# EAGLE design Tx_ckt_1 (EAGLE 9.6.2)
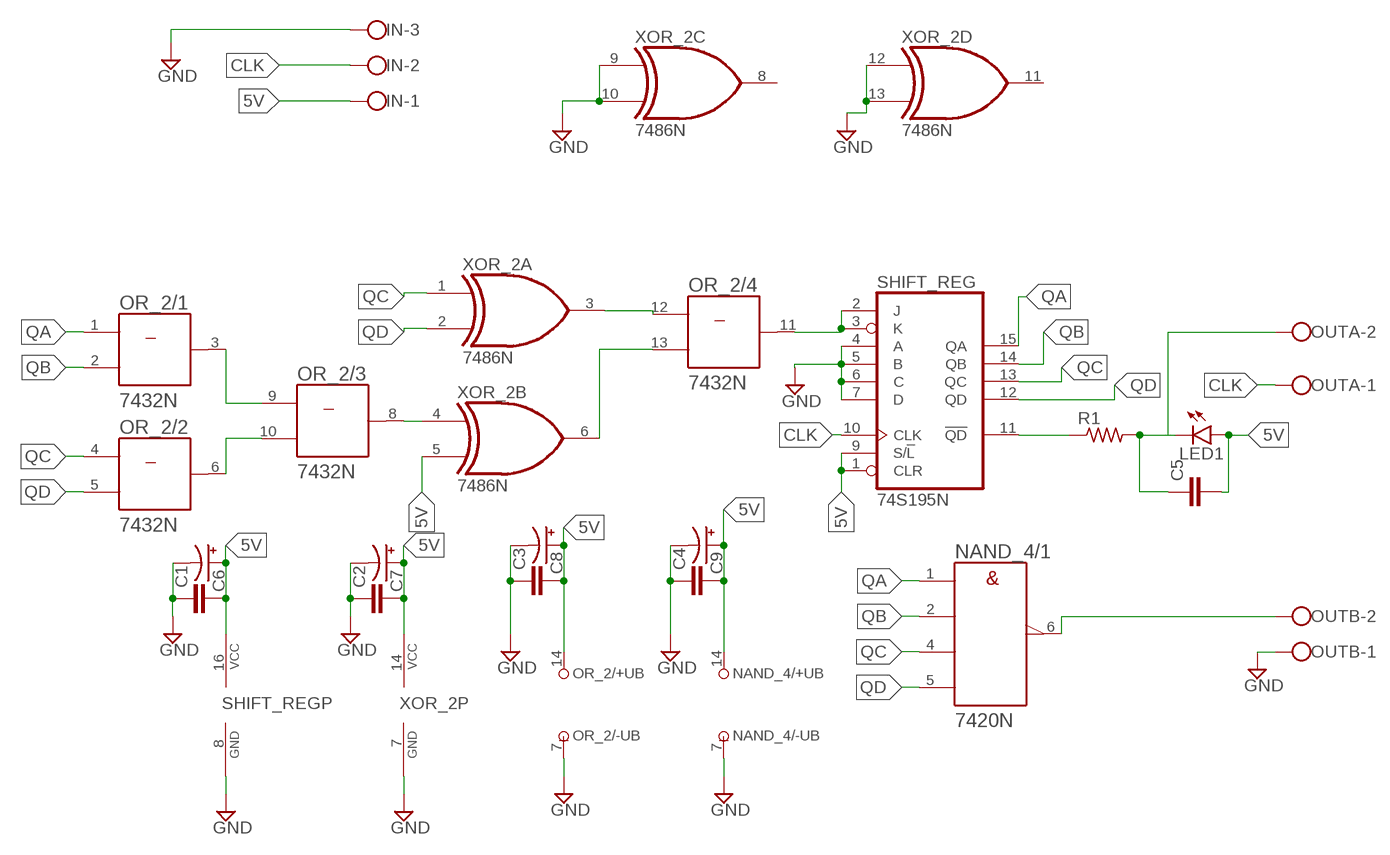
[diagram p0: schematic, sheet 1]

## Parts
C1  C-EU050-025X075  [C050-025X075]
C2  C-EU050-025X075  [C050-025X075]
C3  C-EU050-025X075  [C050-025X075]
C4  C-EU050-025X075  [C050-025X075]
C5  C-EU050-025X075  [C050-025X075]
C6  CPOL-USE2.5-7  [E2,5-7]
C7  CPOL-USE2.5-7  [E2,5-7]
C8  CPOL-USE2.5-7  [E2,5-7]
C9  CPOL-USE2.5-7  [E2,5-7]
IN  W237-103  [W237-103]
LED1  LED5MM  [LED5MM]
NAND_4  7420N  [DIL14]
OR_2  7432N  [DIL14]
OUTA  W237-102  [W237-102]
OUTB  W237-102  [W237-102]
R1  R-US_0207/10  [0207/10]
SHIFT_REG  74S195N  [DIL16]
XOR_2  7486N  [DIL14]

## Nets
5V: C1.2 C2.2 C3.2 C4.2 C5.2 C6.+ C7.+ C8.+ C9.+ IN.1 LED1.A NAND_4.14(/+UB:+UB) OR_2.14(/+UB:+UB) SHIFT_REG.1(CLR) SHIFT_REG.9(S/!L) SHIFT_REG.16(VCC) XOR_2.5(B:I1) XOR_2.14(P:VCC)
CLK: IN.2 OUTA.1 SHIFT_REG.10(CLK)
GND: C1.1 C2.1 C3.1 C4.1 C6.- C7.- C8.- C9.- IN.3 NAND_4.7(/-UB:-UB) OR_2.7(/-UB:-UB) OUTB.1 SHIFT_REG.4(A) SHIFT_REG.5(B) SHIFT_REG.6(C) SHIFT_REG.7(D) SHIFT_REG.8(GND) XOR_2.7(P:GND) XOR_2.9(C:I0) XOR_2.10(C:I1) XOR_2.12(D:I0) XOR_2.13(D:I1)
N$1: OR_2.11(/4:Y) SHIFT_REG.2(J) SHIFT_REG.3(K)
N$2: OR_2.12(/4:A) XOR_2.3(A:O)
N$3: OR_2.13(/4:B) XOR_2.6(B:O)
N$4: R1.1 SHIFT_REG.11(!QD)
N$5: C5.1 LED1.K(C) OUTA.2 R1.2
N$7: NAND_4.6(/1:Y) OUTB.2
N$8: OR_2.3(/1:Y) OR_2.9(/3:A)
N$9: OR_2.6(/2:Y) OR_2.10(/3:B)
N$10: OR_2.8(/3:Y) XOR_2.4(B:I0)
QA: NAND_4.1(/1:A) OR_2.1(/1:A) SHIFT_REG.15(QA)
QB: NAND_4.2(/1:B) OR_2.2(/1:B) SHIFT_REG.14(QB)
QC: NAND_4.4(/1:C) OR_2.4(/2:A) SHIFT_REG.13(QC) XOR_2.1(A:I0)
QD: NAND_4.5(/1:D) OR_2.5(/2:B) SHIFT_REG.12(QD) XOR_2.2(A:I1)
Unconnected: NAND_4.8(/2:Y) NAND_4.9(/2:A) NAND_4.10(/2:B) NAND_4.12(/2:C) NAND_4.13(/2:D) XOR_2.8(C:O) XOR_2.11(D:O)

## Library data of the parts
C1-C5 = rcl:C-EU: CAPACITOR, European symbol; SPICEPREFIX: C
C6-C9 = rcl:CPOL-US: POLARIZED CAPACITOR, American symbol; SPICEPREFIX: C
IN = con-wago-500:W237-103: WAGO SCREW CLAMP; MPN: 237-103; OC_FARNELL: unknown; OC_NEWARK: 18M7116
LED1 = led:LED: LED OSRAM: - CHIPLED LG R971, LG N971, LY N971, LG Q971, LY Q971, LO R971, LY R971 LH N974, LH R974 LS Q976, LO Q976, LY Q976 LO Q996 - Hyper CHIPLED LW Q18S LB Q993, LB Q99A, LB R99A - SideLED LS A670, LO A670, LY A670, LG A670, LP A670 LB A673, LV A673, LT A673, LW A673 LH A674 LY A675 LS A676, LA A676, LO A676, LY A676, LW A676 LS A679, LY A679, LG A679 - Hyper Micro SIDELED® LS Y876, LA Y876, LO Y876, LY Y876 LT Y87S - SmartLED LW L88C, LW L88S LB L89C, LB L89S, LG L890 LS L89K, LO L89K, LY L89K LS L896, LA L896, LO L896, LY L896 - TOPLED LS T670, LO T670, LY T670, LG T670, LP T670 LSG T670, LSP T670, LSY T670, LOP T670, LYG T670 LG T671, LOG T671, LSG T671 LB T673, LV T673, LT T673, LW T673 LH T674 LS T676, LA T676, LO T676, LY T676, LB T676, LH T676, LSB T676, LW T676 LB T67C, LV T67C, LT T67C, LS T67K, LO T67K, LY T67K, LW E67C LS E67B, LA E67B, LO E67B, LY E67B, LB E67C, LV E67C, LT E67C LW T67C LS T679, LY T679, LG T679 LS T770, LO T770, LY T770, LG T770, LP T770 LB T773, LV T773, LT T773, LW T773 LH T774 LS E675, LA E675, LY E675, LS T675 LS T776, LA T776, LO T776, LY T776, LB T776 LHGB T686 LT T68C, LB T68C - Hyper Mini TOPLED® LB M676 - Mini TOPLED Santana® LG M470 LS M47K, LO M47K, LY M47K Source: http://www.osram.convergy.de LUXEON: - LUMILED® LXK2-PW12-R00, LXK2-PW12-S00, LXK2-PW14-U00, LXK2-PW14-V00 LXK2-PM12-R00, LXK2-PM12-S00, LXK2-PM14-U00 LXK2-PE12-Q00, LXK2-PE12-R00, LXK2-PE12-S00, LXK2-PE14-T00, LXK2-PE14-U00 LXK2-PB12-K00, LXK2-PB12-L00, LXK2-PB12-M00, LXK2-PB14-N00, LXK2-PB14-P00, LXK2-PB14-Q00 LXK2-PR12-L00, LXK2-PR12-M00, LXK2-PR14-Q00, LXK2-PR14-R00 LXK2-PD12-Q00, LXK2-PD12-R00, LXK2-PD12-S00 LXK2-PH12-R00, LXK2-PH12-S00 LXK2-PL12-P00, LXK2-PL12-Q00, LXK2-PL12-R00 Source: www.luxeon.com KINGBRIGHT: KA-3528ASYC Source: www.kingbright.com
NAND_4 = 74ttl-din:74*20: Dual 4-input NAND gate
OR_2 = 74ttl-din:74*32: Quad 2-input OR gate
OUTA OUTB = con-wago-500:W237-102: WAGO SCREW CLAMP; MPN: 237-102; OC_FARNELL: unknown; OC_NEWARK: 70K9898
R1 = rcl:R-US_: RESISTOR, American symbol; SPICEPREFIX: R
SHIFT_REG = 74xx-us:74*195: 4-bit parallel access SHIFT REGISTER
XOR_2 = 74xx-us:74*86: Quad 2-input EXCLUSIV-OR (XOR) gate

## Board
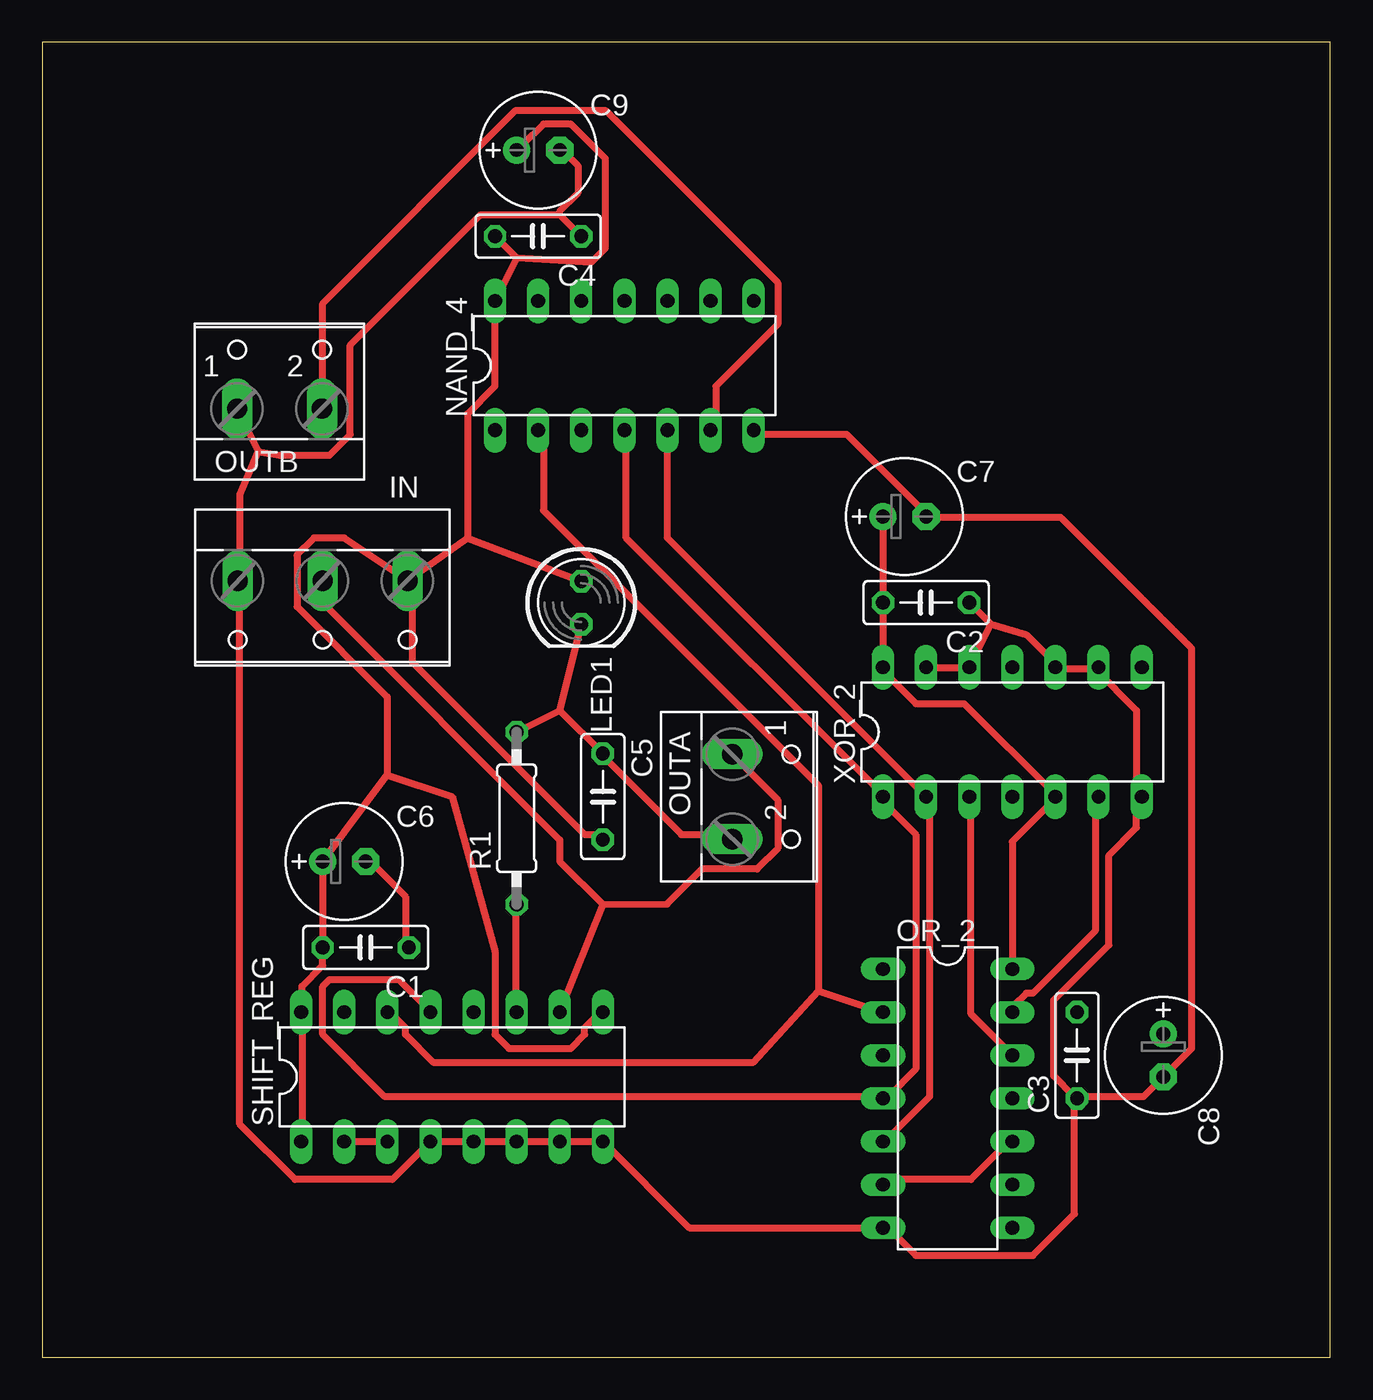
[diagram p1: board, top side]
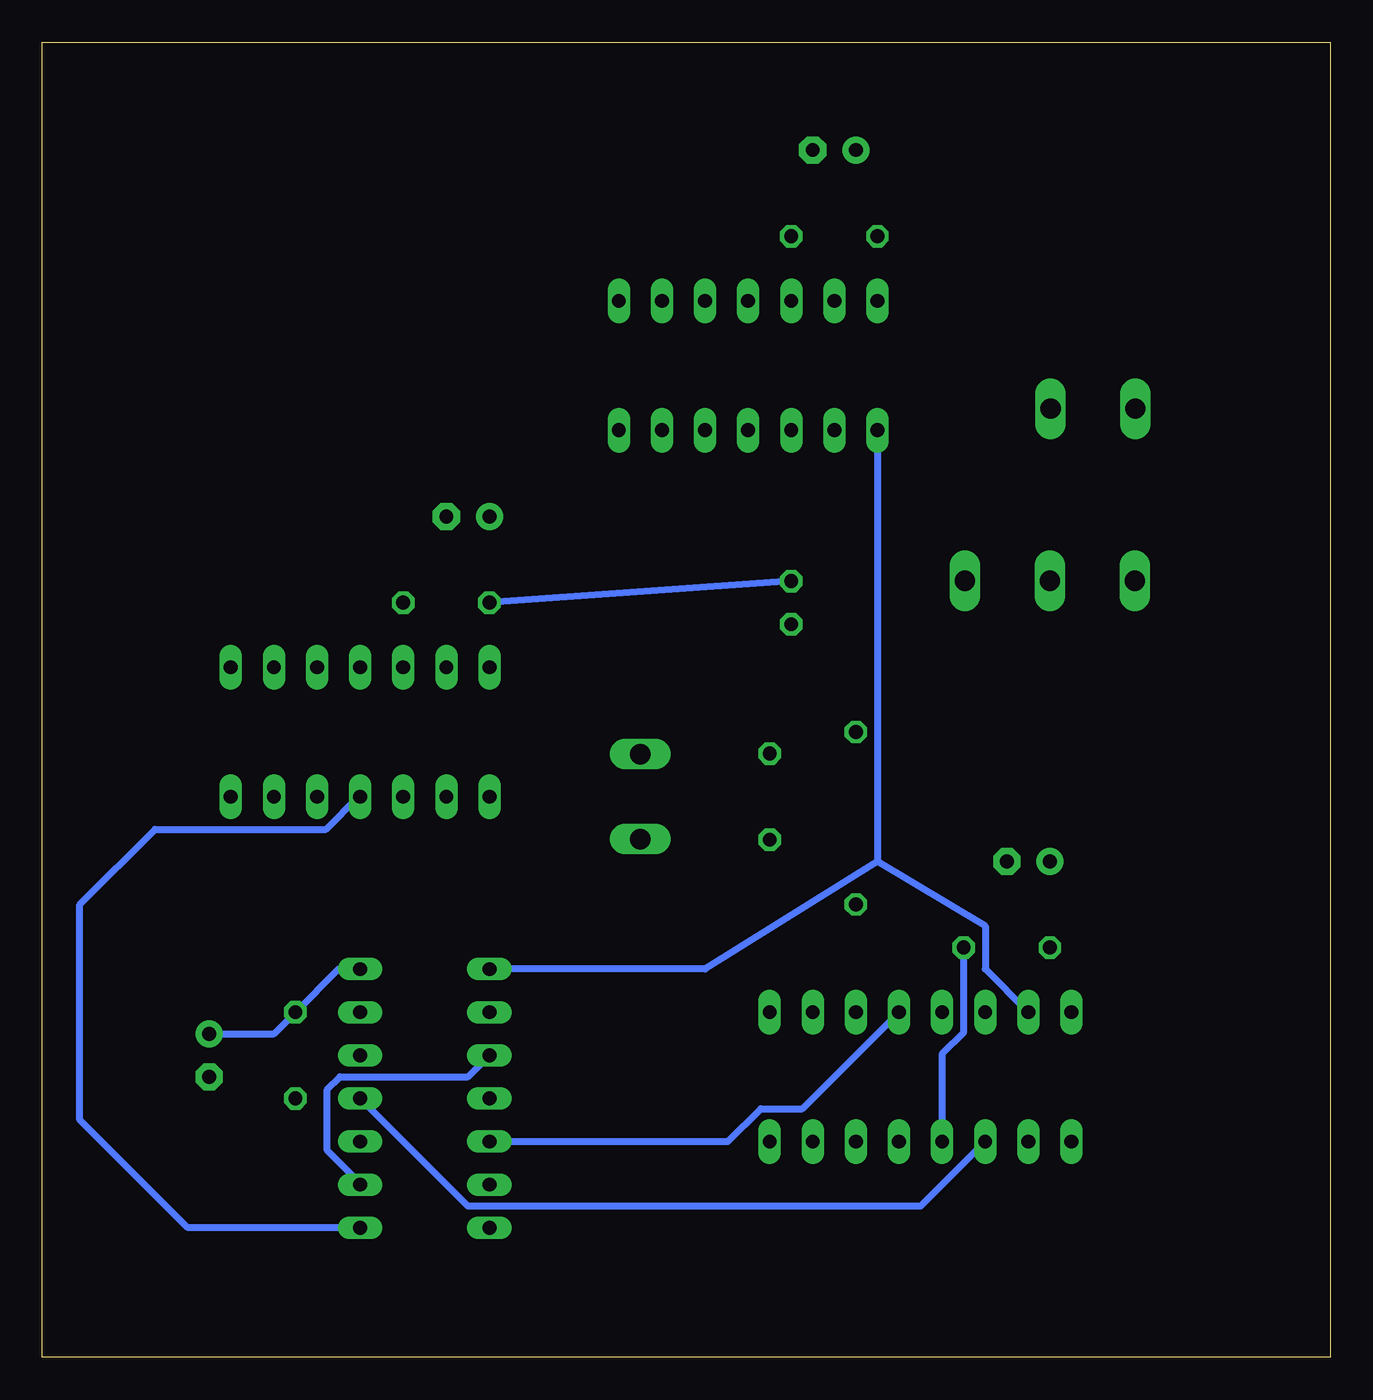
[diagram p2: board, bottom side, seen from below]

Size 75.87 x 77.46 mm. Coordinates in mm from the lower left corner, seen from the top.
Outline: 0,0 75.87,0 75.87,77.46 0,77.46 0,0
Copper layers (1*16): Top 0.035mm / dielectric 1.5mm / Bottom 0.035mm
Design rules "default *": minimum track width 16mil, minimum drill 0.8mm, track to track 16mil, track to pad 16mil, pad to pad 16mil, via to via 16mil, smd to smd 16mil, copper to edge 40mil, drill to drill 24mil, minimum pad ring 10mil, minimum via ring 8mil, stop-mask expansion 4mil, vias tented up to drill 0mil, thermal gap 10mil

### Footprints (pad centres in the part's own frame; a part is rotated, then mirrored left to right if it is on the bottom)
C050-025X075 = drill 0.813 octagon: 1 -2.54,0; 2 2.54,0
E2,5-7 = drill 0.813 pad 1.6: + -1.27,0 | drill 0.813 pad 1.6 octagon: - 1.27,0
W237-103 = drill 1.194 long: 1 -5,-1.29; 2 0,-1.29; 3 5,-1.29
LED5MM = drill 0.813 octagon: A -1.27,0; K 1.27,0
DIL14 = drill 0.813 long: 1 -7.62,-3.81; 2 -5.08,-3.81; 3 -2.54,-3.81; 4 0,-3.81; 5 2.54,-3.81; 6 5.08,-3.81; 7 7.62,-3.81; 8 7.62,3.81; 9 5.08,3.81; 10 2.54,3.81; 11 0,3.81; 12 -2.54,3.81; 13 -5.08,3.81; 14 -7.62,3.81
W237-102 = drill 1.194 long: 1 -2.5,-1.27; 2 2.5,-1.27
0207/10 = drill 0.813 octagon: 1 -5.08,0; 2 5.08,0
DIL16 = drill 0.813 long: 1 -8.89,-3.81; 2 -6.35,-3.81; 3 -3.81,-3.81; 4 -1.27,-3.81; 5 1.27,-3.81; 6 3.81,-3.81; 7 6.35,-3.81; 8 8.89,-3.81; 9 8.89,3.81; 10 6.35,3.81; 11 3.81,3.81; 12 1.27,3.81; 13 -1.27,3.81; 14 -3.81,3.81; 15 -6.35,3.81; 16 -8.89,3.81

### Placement (x,y rotation side)
C1  19.05,24.13 180 top
C2  52.07,44.45 180 top
C3  60.96,17.78 90 top
C4  29.21,66.04 180 top
C5  33.02,33.02 270 top
C6  17.78,29.21 0 top
C7  50.8,49.53 0 top
C8  66.04,17.78 270 top
C9  29.21,71.12 0 top
IN  16.51,44.45 180 top
LED1  31.75,44.45 270 top
NAND_4  34.29,58.42 0 top
OR_2  53.34,15.24 270 top
OUTA  41.91,33.02 270 top
OUTB  13.97,57.15 0 top
R1  27.94,31.75 90 top
SHIFT_REG  24.13,16.51 0 top
XOR_2  57.15,36.83 0 top

### Tracks (layer width: path | path; a pad name or v marks a point on that pad's centre or on a via)
5V
  Top 0.406: SHIFT_REG.1 15.29,12.9 15.29,20.22 SHIFT_REG.16 15.29,20.62 15.29,21.84 16.51,23.06 C1.2 C6.+ 20.32,34.29 | SHIFT_REG.9 32.77,20.22 31.95,19.41 31.95,19 31.14,18.19 27.48,18.19 26.67,19 26.67,23.88 24.13,33.02 20.32,34.29 | C9.+ 28.3,71.42 29.52,72.64 31.14,72.64 33.17,70.61 33.17,65.33 32.36,64.52 27.94,64.77 | C5.2 32.77,30.79 31.95,30.79 21.79,40.95 21.79,45.46 IN.1 | 25.04,48.26 25.04,55.58 26.67,57.2 NAND_4.14 27.94,64.77 | OR_2.14 57.15,30.38 59.59,32.82 XOR_2.5 59.59,33.22 54.31,38.51 51.46,38.51 49.43,40.54 XOR_2.14 C2.2 C7.+ | IN.1 25.04,48.26 | 25.04,48.26 LED1.A | IN.1 17.78,48.26 16.01,48.26 14.99,47.24 15,47.23 15,44.22 15.01,44.22 20.32,38.91 20.32,34.29 | C4.2 27.94,64.77
  Bottom 0.406: C8.+ 62.23,19.05 C3.2 58.42,22.86 OR_2.14 | LED1.A C2.2
CLK
  Top 0.406: OUTA.1 40.89,35.26 43.33,32.82 43.33,29.97 42.11,28.75 38.86,28.75 36.81,26.7 33.02,26.67 | IN.2 16.51,44.45 30.48,30.48 30.48,29.21 33.02,26.67 | 33.02,26.67 SHIFT_REG.10
GND
  Top 0.406: C1.1 21.39,24.28 21.39,27.13 19.36,29.16 C6.- | C9.- 30.73,71.02 31.55,70.21 31.55,68.58 30.48,67.51 30.48,67.31 | 62.03,40.54 60,40.54 XOR_2.10 59.59,40.95 57.96,42.57 55.88,43.18 | 62.03,40.54 64.47,38.1 64.47,33.22 XOR_2.7 64.47,32.82 64.47,31.19 62.84,29.57 62.84,24.28 59.59,21.03 59.59,16.56 60.81,15.34 C3.1 | 62.03,40.54 XOR_2.9 | NAND_4.7 42.11,54.36 47.4,54.36 51.87,49.89 C7.- 52.27,49.48 60,49.48 67.72,41.76 67.72,18.19 C8.- 64.87,15.34 61.21,15.34 C3.1 | C3.1 60.81,14.94 60.81,8.43 58.37,5.99 51.46,5.99 49.84,7.62 OR_2.7 38.1,7.62 SHIFT_REG.8 SHIFT_REG.7 SHIFT_REG.6 SHIFT_REG.5 SHIFT_REG.4 20.63,10.46 14.88,10.46 11.63,13.72 11.63,45.41 IN.3 11.63,45.82 11.63,50.8 12.7,53.34 | OUTB.1 12.7,53.34 | 12.7,53.34 13.97,53.14 16.92,53.14 18.14,54.36 18.14,59.64 25.81,67.31 30.48,67.31 | XOR_2.13 XOR_2.12 55.88,43.18 | C2.1 55.88,43.18 | C4.1 30.48,67.31
  Bottom 0.406: C1.1 21.59,19.13 22.86,17.86 SHIFT_REG.4
N$1
  Top 0.406: SHIFT_REG.2 SHIFT_REG.3
  Bottom 0.406: SHIFT_REG.3 24.13,8.89 50.8,8.89 OR_2.11
N$2
  Top 0.406: OR_2.12 54.71,20.22 54.71,32.82 XOR_2.3
N$3
  Top 0.406: OR_2.13 57.15,20.62 57.96,21.44 58.37,21.44 62.03,25.1 62.03,32.82 XOR_2.6
N$4
  Top 0.406: SHIFT_REG.11 27.89,20.62 27.89,26.31 R1.1
N$5
  Top 0.406: OUTA.2 40.49,30.79 37.64,30.79 33.17,35.26 C5.1 30.48,38.1 | R1.2 30.48,38.1 | LED1.K 30.48,38.1
N$7
  Top 0.406: NAND_4.6 39.67,54.76 39.67,57.2 43.33,60.86 43.33,63.3 33.17,73.46 27.89,73.46 16.51,62.08 16.51,55.98 OUTB.2
N$8
  Bottom 0.406: OR_2.3 50.8,16.51 58.34,16.51 59.08,15.77 59.08,12.17 57.15,10.24 OR_2.9
N$9
  Top 0.406: OR_2.6 49.84,10.46 54.71,10.46 57.15,12.9 OR_2.10
N$10
  Bottom 0.406: OR_2.8 67.31,7.62 73.66,13.97 73.66,26.67 69.24,31.09 59.16,31.09 57.23,33.02 XOR_2.4
QA
  Bottom 0.406: SHIFT_REG.15 20.32,22.86 20.32,25.4 26.67,29.21 | OR_2.1 36.83,22.86 26.67,29.21 | NAND_4.1 26.67,29.21
QB
  Top 0.406: SHIFT_REG.14 20.57,20.22 21.39,19.41 21.39,19 23.01,17.37 41.91,17.37 45.72,21.59 | NAND_4.2 29.52,54.36 29.52,49.89 45.72,33.68 45.72,21.59 | 45.72,21.59 OR_2.2
QC
  Top 0.406: SHIFT_REG.13 22.61,20.62 20.98,22.25 16.92,22.25 16.51,21.84 16.51,19 20.17,15.34 49.43,15.34 OR_2.4 49.84,15.34 51.46,16.97 51.46,30.79 49.43,32.82 XOR_2.1 49.43,33.22 34.39,48.26 34.39,54.36 NAND_4.4
QD
  Top 0.406: OR_2.5 49.84,12.9 52.27,15.34 52.27,32.82 XOR_2.2 36.83,48.26 NAND_4.5
  Bottom 0.406: OR_2.5 35.48,12.7 33.55,14.63 31.09,14.63 SHIFT_REG.12